# EasyEDA Pro project 自动分拣系统V2.epro

# Schematic Schematic1
Create Date: 2025-10-03; Page Name: P1; Project Name: 自动分拣系统; Schematic Name: Schematic1; Update Date: 2025-10-03; Company: 嘉立创EDA; Page Size: A4; Version: V1.0
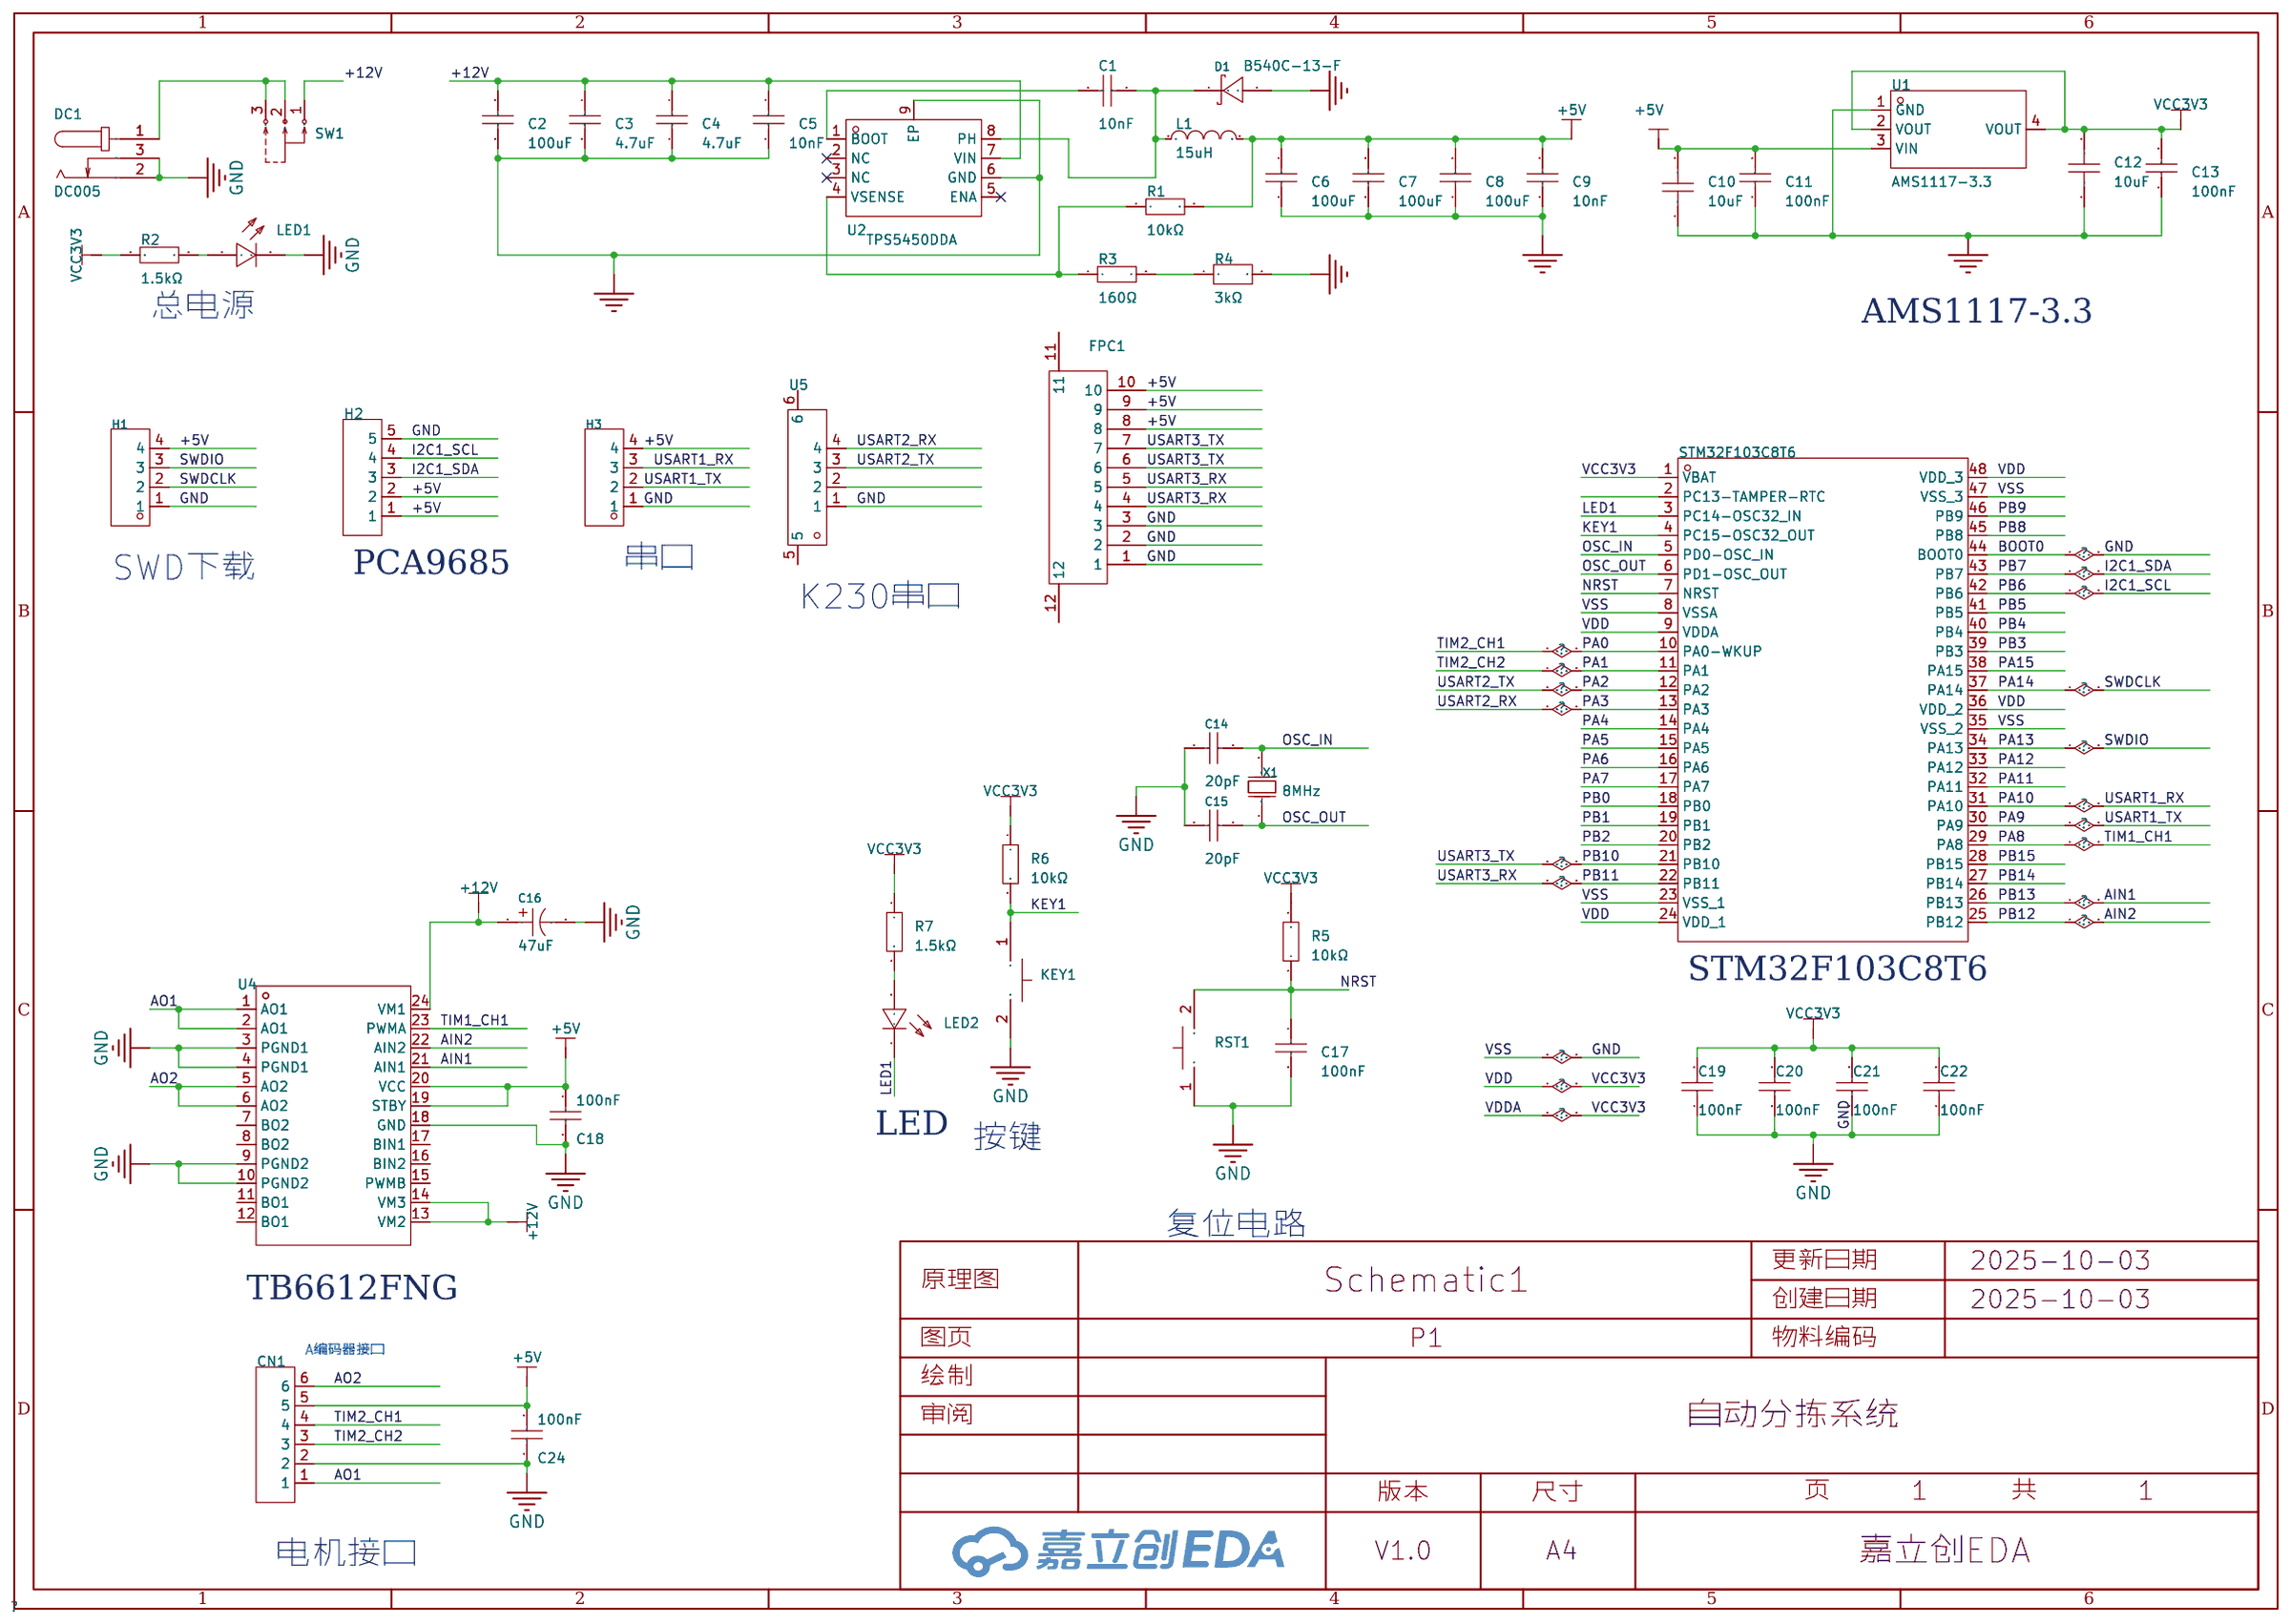
[diagram p0: schematic sheet]

## Parts
C1  10nF  [C0603]
C2  100uF  [C1206]
C3  4.7uF  [C0603]
C4  4.7uF  [C0603]
C5  10nF  [C0603]
C6  100uF  [C1206]
C7  100uF  [C1206]
C8  100uF  [C1206]
C9  10nF  [C0603]
C10  10uF  [C0603]
C11  100nF  [C0603]
C12  10uF  [C0603]
C13  100nF  [C0603]
C14  20pF  [C0603]
C15  20pF  [C0603]
C16  47uF  [CAP-SMD_BD6.3-L6.6-W6.6-LS7.2-FD]
C17  100nF  [C0603]
C18  100nF  [C0603]
C19  100nF  [C0603]
C20  100nF  [C0603]
C21  100nF  [C0603]
C22  100nF  [C0603]
C24  100nF  [C0603]
CN1  BX-PH2.0-6PWZ  [CONN-TH_6P-P2.00_BX-PH2.0-6PWZ]
D1  B540C-13-F  [SMC_L7.1-W6.2-LS8.1-RD]
DC1  DC005  [DC-IN-TH_DC005]
FPC1  AFC01-S10FCA-00  [FPC-SMD_P0.5-10P_FGS-XJ-H2.0]
H1  PZ254V-11-04P  [HDR-TH_4P-P2.54-V-M]
H2  PZ254V-11-05P  [HDR-TH_5P-P2.54-V-M]
H3  PZ254V-11-04P  [HDR-TH_4P-P2.54-V-M]
KEY1  3*6*5贴片-2P  [SW-SMD_L6.0-W3.5-LS8.0]
L1  15uH  [IND-SMD_L7.0-W6.6_FXL0630]
LED1  NCD0603G1  [LED0603-RD]
LED2  NCD0603G1  [LED0603-RD]
R1  10kΩ  [R0603]
R2  1.5kΩ  [R0603]
R3  160Ω  [R0603]
R4  3kΩ  [R0603]
R5  10kΩ  [R0603]
R6  10kΩ  [R0603]
R7  1.5kΩ  [R0603]
RST1  3*6*5贴片-2P  [SW-SMD_L6.0-W3.5-LS8.0]
SW1  SS12D10/G5/直角  [SW-TH_SHOU-HAN_SS12D10G4]
U1  AMS1117-3.3  [SOT-223-3_L6.5-W3.4-P2.30-LS7.0-BR]
U2  TPS5450DDA  [SOP-8_L4.9-W3.9-P1.27-LS6.0-TL-EP-1]
U3  STM32F103C8T6  [LQFP-48_L7.0-W7.0-P0.50-LS9.0-BL]
U4  TB6612FNG,C,8,EL  [SSOP-24_L8.3-W5.6-P0.65-LS7.6-BL]
U5  1.25-4PWT  [CONN-SMD_4P-P1.25-4PWT]
X1  8MHz  [CRYSTAL-SMD_4P-L3.2-W2.5-BL_SIT8008BI]

## Library data of the parts
C1 C5 C9 = CC0603KRX7R9BB103: 容值:10nF;精度:±10%;额定电压:50V;材质(温度系数):X7R;; LCSC Part Name: 10nF ±10% 50V; Supplier Part: C100042; Manufacturer: YAGEO(国巨); Supplier Footprint: 0603; JLCPCB Part Class: 扩展库; Datasheet: https://atta.szlcsc.com/upload/public/pdf/source/20181008/C309510_22F155564471FAF6A489F7D68F34234E.pdf; Supplier: LCSC; Tolerance: ±10%; Voltage Rated: 50V; Temperature Coefficient: X7R
C2 C6-C8 = CL31A107MQHNNNE: 容值:100uF;精度:±20%;额定电压:6.3V;材质(温度系数):X5R;; LCSC Part Name: 100uF ±20% 6.3V; Supplier Part: C15008; Manufacturer: SAMSUNG(三星); Supplier Footprint: 1206; JLCPCB Part Class: 基础库; Datasheet: https://atta.szlcsc.com/upload/public/pdf/source/20160218/1457707763339.pdf; Supplier: LCSC; Tolerance: ±20%; Voltage Rated: 6.3V; Temperature Coefficient: X5R
C3 C4 = CL10A475KA8NQNC: 容值:4.7uF;精度:±10%;额定电压:25V;材质(温度系数):X5R;; LCSC Part Name: 4.7uF ±10% 25V; Supplier Part: C69335; Manufacturer: SAMSUNG(三星); Supplier Footprint: 0603; JLCPCB Part Class: 扩展库; Datasheet: https://atta.szlcsc.com/upload/public/pdf/source/20161108/1478586410580.pdf; Supplier: LCSC; Tolerance: ±10%; Voltage Rated: 25V; Temperature Coefficient: X5R
C10 C12 = GRM21BR61H106KE43L: 容值:10uF;精度:±10%;额定电压:50V;材质(温度系数):X5R;; LCSC Part Name: 10uF ±10% 50V; Supplier Part: C440198; Manufacturer: muRata(村田); Supplier Footprint: 0805; JLCPCB Part Class: 基础库; Datasheet: https://atta.szlcsc.com/upload/public/pdf/source/20230811/95AAE0C9AF55EDC31B7A4D8B733F534E.pdf; Supplier: LCSC; Tolerance: ±10%; Voltage Rated: 50V; Temperature Coefficient: X5R
C11 C13 = 0603B104K500NT: 容值:100nF;精度:±10%;额定电压:50V;材质(温度系数):X7R;; LCSC Part Name: 100nF ±10% 50V; Supplier Part: C30926; Manufacturer: FH(风华); Supplier Footprint: 0603; JLCPCB Part Class: 扩展库; Datasheet: https://atta.szlcsc.com/upload/public/pdf/source/20200305/C486355_26A10D38EF8C2A5C37091D0039909270.pdf; Supplier: LCSC; Tolerance: ±10%; Voltage Rated: 50V; Temperature Coefficient: X7R
C14 C15 = CL10C200JB8NNNC: 容值:20pF;精度:±5%;额定电压:50V;材质(温度系数):C0G;; LCSC Part Name: 20pF ±5% 50V; Supplier Part: C1648; Manufacturer: SAMSUNG(三星); Supplier Footprint: 0603; JLCPCB Part Class: Basic Part; Datasheet: https://atta.szlcsc.com/upload/public/pdf/source/20160218/1457707763339.pdf; Supplier: LCSC; Tolerance: ±5%; Voltage Rated: 50V; Temperature Coefficient: C0G
C16 = RVT47UF35V67RV0039: 容值:47uF;额定电压:35V;电容体直径:-;电容体长度:-;纹波电流:-;等效串联电阻:-;工作寿命:2000hrs@105℃;; LCSC Part Name: 47uF 35V; Supplier Part: C2836440; Manufacturer: KNSCHA(科尼盛); Supplier Footprint: SMD,6.3x5.4mm; JLCPCB Part Class: 扩展库; Supplier: LCSC; Rated Voltage: 35V; Lifetime @ Temp: 2000hrs@105℃
C17 C18 C24 = 0603B104K500NT: 容值:100nF;精度:±10%;额定电压:50V;材质(温度系数):X7R;; LCSC Part Name: 100nF ±10% 50V; Supplier Part: C30926; Manufacturer: FH(风华); Supplier Footprint: 0603; JLCPCB Part Class: 扩展库; Datasheet: https://atta.szlcsc.com/upload/public/pdf/source/20170923/C30926_1506149436298988724.pdf; Supplier: LCSC; Tolerance: ±10%; Voltage Rated: 50V; Temperature Coefficient: X7R
C19-C22 = 0603B104K500NT: 容值:100nF;精度:±10%;额定电压:50V;材质(温度系数):X7R;; LCSC Part Name: 100nF ±10% 50V; Supplier Part: C30926; Manufacturer: FH(风华); Supplier Footprint: 0603; JLCPCB Part Class: Extended Part; Datasheet: https://atta.szlcsc.com/upload/public/pdf/source/20200305/C486355_26A10D38EF8C2A5C37091D0039909270.pdf; Supplier: LCSC; Tolerance: ±10%; Voltage Rated: 50V; Temperature Coefficient: X7R
CN1 = BX-PH2.0-6PWZ: 插针结构:1x6P;间距:2mm;安装方式:弯插;参考系列:PH;总PIN数:6P;排数:1;每排PIN数:6;行距:-;额定电流:2A;触头材质:黄铜;触头镀层:锡;工作温度:-25℃~+85℃;; LCSC Part Name: 1x6P 间距:2mm 弯插 系列:PH; Supplier Part: C18077757; Manufacturer: Bossie(博锡); Supplier Footprint: 弯插,P=2mm; JLCPCB Part Class: 扩展库; Datasheet: https://item.szlcsc.com/datasheet/BX-PH2.0-6PWZ/19218158.html; Supplier: LCSC; Pins Structure: 1x6P; Pitch: 2mm; Mounting Type: 弯插; Reference Series: PH; Number of Pins: 6P; Number of Rows: 1; Number of PINs Per Row: 6; Current Rating: 2A; Contact Material: 黄铜; Contact Plating: 锡; Operating Temperature: -25℃~+85℃; Voltage Rating: 250V; Plastic Material: PA66; Flame Retardant Rating: UL94V-0; Color: 白色; Z-Height of the Board: 4.7mm; X-Length of Bottom Edge on Board (Spacing Line): 14mm; Y-Width of Bottom Edge on Board: 6.05mm
D1 = B540C-13-F: 直流反向耐压(Vr):40V;平均整流电流(Io):5A;正向压降(Vf):550mV@5A;; LCSC Part Name: 电压:40V 电流:5A; Supplier Part: C72264; Manufacturer: DIODES(美台); Supplier Footprint: SMC(DO-214AB); JLCPCB Part Class: 扩展库; Datasheet: https://atta.szlcsc.com/upload/public/pdf/source/20171023/C134461_15087453602301052556.pdf; Supplier: LCSC; Reverse Voltage (Vr): 40V; Average Rectified Current (Io): 5A; Forward Voltage (Vf@If): 550mV@5A; Reverse Leakage Current (Ir): 500uA@40V
DC1 = DC005: 连接器类型:DC电源插座;安装方式:弯插;触点内径:2mm;触点外径:6.3mm;额定电流:500mA;额定电压:30V;工作温度范围:-40℃~+55℃;; LCSC Part Name: DC电源插座 内径:2mm 外径:6.3mm; Supplier Part: C431533; Manufacturer: SHOU HAN(首韩); Supplier Footprint: 插件; JLCPCB Part Class: 扩展库; Datasheet: https://atta.szlcsc.com/upload/public/pdf/source/20190925/C431533_4751811035784AC1D38EBC85F7905E99.pdf; Supplier: LCSC; Connector Type: DC电源插座; Mounting Style: 弯插; Inside Contact Diameter: 2mm; Outside Contact Diameter: 6.3mm; Current Rating (Max): 500mA; Voltage Rating (Max): 30V; Operating Temperature Range: -40℃~+55℃
FPC1 = AFC01-S10FCA-00: 锁定特性:翻盖式;触点类型:下接;触点数量:10P;间距:0.5mm;安装方式:卧贴;; LCSC Part Name: 间距:0.5mm P数:10P 翻盖式 下接; Supplier Part: C262659; Manufacturer: JS(钜硕电子); Supplier Footprint: SMD,P=0.5mm,卧贴; Datasheet: https://item.szlcsc.com/datasheet/AFC01-S10FCA-00/253918.html; Supplier: LCSC; Locking Feature: 翻盖式; Contact Type: 下接; Number of Contacts: 10P; Pitch: 0.5mm; Mounting Type: 卧贴; FFC, FCB Thickness: 0.3mm; Height Above Board: 2mm
H1 H3 = PZ254V-11-04P: 排数:单排;总PIN位数:4P;间距:2.54mm;插针结构:1x4P;行距:-;安装类型:直插;圆针/方针:方针;额定电流:3A;额定电压:250V;配合针长度:6mm;塑高:2.5mm;端接针长度:3mm;触头材质:-;工作温度范围:-40℃~+105℃;颜色:黑色;; LCSC Part Name: 2.54mm 1x4P 直插 方针; Supplier Part: C2691448; Manufacturer: XFCN(兴飞); Supplier Footprint: 插件,P=2.54mm; JLCPCB Part Class: 扩展库; Datasheet: https://atta.szlcsc.com/upload/public/pdf/source/20200309/C492403_F9F19131791D08044AD4F84F8E751A34.pdf; Supplier: LCSC; Number of Rows: 单排; Number of Pins: 4P; Pitch: 2.54mm; Pin Structure: 1x4P; Mounting Type: 直插; Circluar Pins/Square Pins: 方针; Current Rating (Max): 3A; Voltage Rating (Max): 250V; Length of Mating Pin: 6mm; Insulation Height: 2.5mm; Length of End Connection Pin: 3mm; Operating Temperature Range: -40℃~+105℃; Color: 黑色
H2 = PZ254V-11-05P: 插针结构:1x5P;间距:2.54mm;行距:-;圆针/方针:方针;安装方式:直插;排数:单排;总PIN位数:5P;额定电流:-;额定电压:-;配合针长度:6mm;塑高:2.5mm;端接针长度:3mm;触头材质:黄铜;触头镀层:-;工作温度:-40℃~+105℃;颜色:黑色;; LCSC Part Name: 1x5P 间距:2.54mm 方针 直插; Supplier Part: C492404; Manufacturer: XFCN(兴飞); Supplier Footprint: 插件,P=2.54mm; JLCPCB Part Class: 扩展库; Datasheet: https://atta.szlcsc.com/upload/public/pdf/source/20200309/C492404_E51533260F8710EFF5D4617281164C1D.pdf; Supplier: LCSC; Pin Structure: 1x5P; Pitch: 2.54mm; Circluar Pins/Square Pins: 方针; Mounting Type: 直插; Number of Rows: 单排; Number of Pins: 5P; Length of Mating Pin: 6mm; Insulation Height: 2.5mm; Length of End Connection Pin: 3mm; Contact Material: 黄铜; Operating Temperature: -40℃~+105℃; Color: 黑色
KEY1 RST1 = 3*6*5贴片-2P: Supplier Part: C9900011307; Supplier Footprint: SW-SMD; JLCPCB Part Class: 扩展库; Supplier: LCSC
L1 = FXL0630-150-M: 电感值:15uH;精度:±20%;额定电流:3A;类型:一体成型电感;饱和电流(Isat):4.5A;; LCSC Part Name: 15uH ±20% 4.5A; Supplier Part: C177243; Manufacturer: cjiang(长江微电); Supplier Footprint: SMD,6.6x7mm; JLCPCB Part Class: 扩展库; Datasheet: https://atta.szlcsc.com/upload/public/pdf/source/20230516/3A080F5AF8C87BB81C3BA86E5F60E51A.pdf; Supplier: LCSC; Tolerance: ±20%; Rated Current: 3A; Type: 一体成型电感; DC Resistance (DCR): 115mΩ; Saturation Current (Isat): 4.5A
LED1 LED2 = NCD0603G1: 发光颜色:翠绿色;正向电压(VF):2.6V~3.6V;功率:72mW;正向电流:10mA;主波长:515nm~530nm;透镜颜色:无色透明;发光强度:330mcd~900mcd;发光角度:130°;工作温度:-30℃~+85℃;; Supplier Part: C84267; Manufacturer: 国星光电; Supplier Footprint: 0603; JLCPCB Part Class: 扩展库; Datasheet: https://atta.szlcsc.com/upload/public/pdf/source/20200820/C84267_04BA7703640BAC111D09F5EFB971FBF3.pdf; Supplier: LCSC; Emitted Color: 翠绿色; Forward Voltage (VF): 2.6V~3.6V; Power Dissipation: 72mW; Forward Current: 10mA; Dominant Wavelength: 515nm~530nm; Lens Color: 无色透明; Luminous Intensity: 330mcd~900mcd; Viewing Angle: 130°; Operating Temperature: -30℃~+85℃
R1 R5 R6 = 0603WAF1002T5E: 阻值:10kΩ;精度:±1%;功率:100mW;温度系数:±100ppm/℃;电阻类型:厚膜电阻;; LCSC Part Name: 10kΩ ±1% 100mW 厚膜电阻; Supplier Part: C25804; Manufacturer: UNI-ROYAL(厚声); Supplier Footprint: 0603; JLCPCB Part Class: 基础库; Datasheet: https://atta.szlcsc.com/upload/public/pdf/source/20200306/C422600_1E6D84923E4A46A82E41ADD87F860B5C.pdf; Supplier: LCSC; Tolerance: ±1%; Power(Watts): 100mW; Overload Voltage (Max): 75V; Temperature Coefficient: ±100ppm/℃; Type: 厚膜电阻; Operating Temperature Range: -55℃~+155℃
R2 R7 = 0603WAF1501T5E: 阻值:1.5kΩ;精度:±1%;功率:100mW;温度系数:±100ppm/℃;电阻类型:厚膜电阻;; LCSC Part Name: 1.5kΩ ±1% 100mW 厚膜电阻; Supplier Part: C22843; Manufacturer: UNI-ROYAL(厚声); Supplier Footprint: 0603; JLCPCB Part Class: 基础库; Datasheet: https://atta.szlcsc.com/upload/public/pdf/source/20200306/C422600_1E6D84923E4A46A82E41ADD87F860B5C.pdf; Supplier: LCSC; Tolerance: ±1%; Power(Watts): 100mW; Overload Voltage (Max): 75V; Temperature Coefficient: ±100ppm/℃; Type: 厚膜电阻; Operating Temperature Range: -55℃~+155℃
R3 = 0603WAF0000T5E: 阻值:0Ω;精度:±1%;功率:100mW;电阻类型:厚膜电阻;; LCSC Part Name: 0Ω ±1% 100mW 厚膜电阻; Supplier Part: C21189; Manufacturer: UNI-ROYAL(厚声); Supplier Footprint: 0603; JLCPCB Part Class: 基础库; Datasheet: https://atta.szlcsc.com/upload/public/pdf/source/20200306/C422600_1E6D84923E4A46A82E41ADD87F860B5C.pdf; Supplier: LCSC; Tolerance: ±1%; Power(Watts): 100mW; Overload Voltage (Max): 75V; Type: 厚膜电阻; Operating Temperature Range: -55℃~+155℃
R4 = FRC0603F3161TS: 阻值:3.16kΩ;精度:±1%;功率:100mW;温度系数:±100ppm/℃;电阻类型:厚膜电阻;; LCSC Part Name: 3.16kΩ ±1% 100mW 厚膜电阻; Supplier Part: C2930087; Manufacturer: FOJAN(富捷); Supplier Footprint: 0603; JLCPCB Part Class: 扩展库; Datasheet: https://atta.szlcsc.com/upload/public/pdf/source/20211221/925EC7D7225764EE0046F22065062C87.pdf; Supplier: LCSC; Tolerance: ±1%; Power(Watts): 100mW; Overload Voltage (Max): 75V; Temperature Coefficient: ±100ppm/℃; Type: 厚膜电阻; Operating Temperature Range: -55℃~+155℃
SW1 = SS12D10/G5/直角: Supplier Part: C9900029541; Supplier Footprint: THrough hole; JLCPCB Part Class: 扩展库; Supplier: LCSC
U1 = AMS1117-3.3_C6186: 输出类型:固定;最大输入电压:-;输出电压:3.3V;输出电流:1A;电源纹波抑制比(PSRR):72dB@(120Hz);输出极性:正;; LCSC Part Name: 输出3.3V 1A; Supplier Part: C6186; Manufacturer: AMS; Supplier Footprint: SOT-223-3; JLCPCB Part Class: 基础库; Datasheet: https://atta.szlcsc.com/upload/public/pdf/source/20180727/C6186_7A095716F0823C02F1997A905E26C086.pdf; Supplier: LCSC; Output Type: 固定; Output Voltage: 3.3V; Output Current: 1A; Power Supply Rejection Ratio (PSRR): 72dB@(120Hz); Dropout Voltage: 1.3V@(800mA); Output Polarity: 正; Number of Outputs: 1
U2 = TPS5450DDA: 功能类型:降压型;同步整流:否;输出类型:可调;输出通道数:1;拓扑结构:降压式;输入电压:5.5V~36V;输出电压:1.221V~31.32V;输出电流(最大值):5A;开关频率:500kHz;工作温度:-40℃~+125℃@(TJ);; LCSC Part Name: 降压型 Vin=5.5V~36V Vout=1.221V~31.32V 5A; Supplier Part: C1355315; Manufacturer: TI(德州仪器); Supplier Footprint: Power-Pad-SO-8; JLCPCB Part Class: 扩展库; Supplier: LCSC; Function: 降压型; Synchronous Rectification: 否; Output Type: 可调; Number of Outputs: 1; Topology: 降压式; Input Voltage: 5.5V~36V; Output Voltage: 1.221V~31.32V; Output Current (Max): 5A; Switching Frequency: 500kHz; Operating Temperature: -40℃~+125℃@(TJ)
U3 = STM32F103C8T6: CPU内核:ARM Cortex-M3;CPU最大主频:72MHz;程序存储容量:64KB;程序存储器类型:FLASH;RAM总容量:20KB;GPIO端口数量:37;ADC(位数):12bit;工作温度范围:-40℃~+85℃;; LCSC Part Name: ARM Cortex-M3 72MHz MSL=3; Supplier Part: C8734; Manufacturer: ST(意法半导体); Supplier Footprint: LQFP-48(7x7); JLCPCB Part Class: 基础库; Datasheet: https://atta.szlcsc.com/upload/public/pdf/source/20220812/8363ACEC51AD55ECEB84799464F7CB85.pdf; Supplier: LCSC; CPU Core: ARM Cortex-M3; CPU Maximum Speed: 72MHz; Operating Voltage Range: 2V~3.6V; Program Storage Size: 64KB; Program Memory Type: FLASH; RAM Size: 20KB; EEPROM: 64KB; GPIO Ports Number: 37; ADC (Bit): 12bit; Peripheral/Function: 看门狗；DMA；看门狗；片载温度传感器; Internal Oscillator: 有; Operating Temperature Range: -40℃~+85℃
U4 = TB6612FNG,C,8,EL: 类型:有刷直流电机;电源电压:2.7V~5.5V;输出电流:1A;接口:并行;; Supplier Part: C141517; Manufacturer: TOSHIBA(东芝); Supplier Footprint: SSOP-24; JLCPCB Part Class: 扩展库; Datasheet: https://atta.szlcsc.com/upload/public/pdf/source/20171128/C141517_15118625624231147036.pdf; Supplier: LCSC; Type: 有刷直流电机; Supply Voltage: 2.7V~5.5V; Output Current: 1A; Interface: 并行; Operating Temperature: -20℃~+85℃@(Ta)
U5 = 1.25-4PWT: Supplier Part: C9900004898; Supplier Footprint: CONN-SMD_4P-P1.25-L10.25-LS5.5; JLCPCB Part Class: 扩展库; Supplier: LCSC
X1 = X49SD8MSD2SC: 晶振类型:直插晶振;频率:8MHz;常温频差:±20ppm;外接负载电容:20pF;频率稳定度(全温):±30ppm;; LCSC Part Name: 8MHz ±20ppm 20pF; Supplier Part: C21263; Manufacturer: YXC(扬兴晶振); Supplier Footprint: HC-49S; JLCPCB Part Class: Extended Part; Datasheet: https://atta.szlcsc.com/upload/public/pdf/source/20210903/A997D130AE99CBB55D9024F9BE6DA174.pdf; Supplier: LCSC; Crystal Type: 直插晶振; Normal temperature Frequency Tolerance: ±20ppm; External load capacitor: 20pF; Frequency Stability(Full temperature range): ±30ppm; Operating Temperature: -20℃~+70℃; Frequency Tolerance: ±10ppm; Frequency Stability: ±50ppm; Load Capacitance: 20pF

## Nets
+5V: C6.2 C7.2 C8.2 C9.2 C10.2 C11.2 C18.1 C24.1 CN1.5 FPC1.8 FPC1.9 FPC1.10 H1.4 H2.1 H2.2 H3.4 L1.2 R1.2 U1.3(VIN) U4.19(STBY) U4.20(VCC)
+12V: C2.2 C3.1 C4.1 C5.2 C16.1 SW1.1 U2.7(VIN) U4.13(VM2) U4.14(VM3) U4.24(VM1)
GND: C2.1 C3.2 C4.2 C5.1 C6.1 C7.1 C8.1 C9.1 C10.1 C11.1 C12.1 C13.1 C14.2 C15.2 C16.2 C17.2 C18.2 C19.1 C20.1 C21.1 C22.1 C24.2 CN1.2 D1.2(A) DC1.2 DC1.3 FPC1.1 FPC1.2 FPC1.3 H1.1 H2.5 H3.1 KEY1.2 LED1.1(K) R4.2 RST1.1 U1.1(GND) U2.6(GND) U2.9(EP) U3.8(VSSA) U3.23(VSS_1) U3.35(VSS_2) U3.44(BOOT0) U3.47(VSS_3) U4.3(PGND1) U4.4(PGND1) U4.9(PGND2) U4.10(PGND2) U4.18(GND) U5.1
VCC3V3: C12.2 C13.2 C19.2 C20.2 C21.2 C22.2 R2.1 R5.2 R6.1 R7.1 U1.2(VOUT) U1.4(VOUT) U3.1(VBAT) U3.9(VDDA) U3.24(VDD_1) U3.36(VDD_2) U3.48(VDD_3)
AIN1: U3.26(PB13) U4.21(AIN1)
AIN2: U3.25(PB12) U4.22(AIN2)
AO1: CN1.1 U4.1(AO1) U4.2(AO1)
AO2: CN1.6 U4.5(AO2) U4.6(AO2)
I2C1_SCL: H2.4 U3.42(PB6)
I2C1_SDA: H2.3 U3.43(PB7)
KEY1: KEY1.1 R6.2 U3.4(PC15-OSC32_OUT)
LED1: LED2.1(K) U3.3(PC14-OSC32_IN)
NRST: C17.1 R5.1 RST1.2 U3.7(NRST)
OSC_IN: C14.1 U3.5(PD0-OSC_IN) X1.2(OSC2)
OSC_OUT: C15.1 U3.6(PD1-OSC_OUT) X1.1(OSC1)
PA0: CN1.4 U3.10(PA0-WKUP)
PA1: CN1.3 U3.11(PA1)
PA2: U3.12(PA2) U5.3
PA3: U3.13(PA3) U5.4
PA4: U3.14(PA4)
PA5: U3.15(PA5)
PA6: U3.16(PA6)
PA7: U3.17(PA7)
PA8: U3.29(PA8) U4.23(PWMA)
PA9: H3.2 U3.30(PA9)
PA10: H3.3 U3.31(PA10)
PA11: U3.32(PA11)
PA12: U3.33(PA12)
PA13: H1.3 U3.34(PA13)
PA14: H1.2 U3.37(PA14)
PA15: U3.38(PA15)
PB0: U3.18(PB0)
PB1: U3.19(PB1)
PB2: U3.20(PB2)
PB3: U3.39(PB3)
PB4: U3.40(PB4)
PB5: U3.41(PB5)
PB8: U3.45(PB8)
PB9: U3.46(PB9)
PB10: FPC1.6 FPC1.7 U3.21(PB10)
PB11: FPC1.4 FPC1.5 U3.22(PB11)
PB14: U3.27(PB14)
PB15: U3.28(PB15)
$1N3060: LED1.2(A) R2.2
$1N3483: LED2.2(A) R7.2
$1N5689: R3.2 R4.1
$1N5690: R1.1 R3.1 U2.4(VSENSE)
$1N5697: C1.2 U2.1(BOOT)
$1N5698: C1.1 D1.1(K) L1.1 U2.8(PH)
$1N11600: DC1.1 SW1.2 SW1.3

Not connected (* = marked no-connect by the designer): FPC1 11 12; U2 2(NC)* 3(NC)* 5(ENA)*; U3 2(PC13-TAMPER-RTC); U4 7(BO2) 8(BO2) 11(BO1) 12(BO1) 15(PWMB) 16(BIN2) 17(BIN1); U5 2 5 6

## Notes on the sheet
- 总电源
- AMS1117-3.3
- SWD下载
- PCA9685
- 串口
- K230串口
- STM32F103C8T6
- LED
- 按键
- 复位电路
- TB6612FNG
- A编码器接口
- 电机接口

# Board PCB1
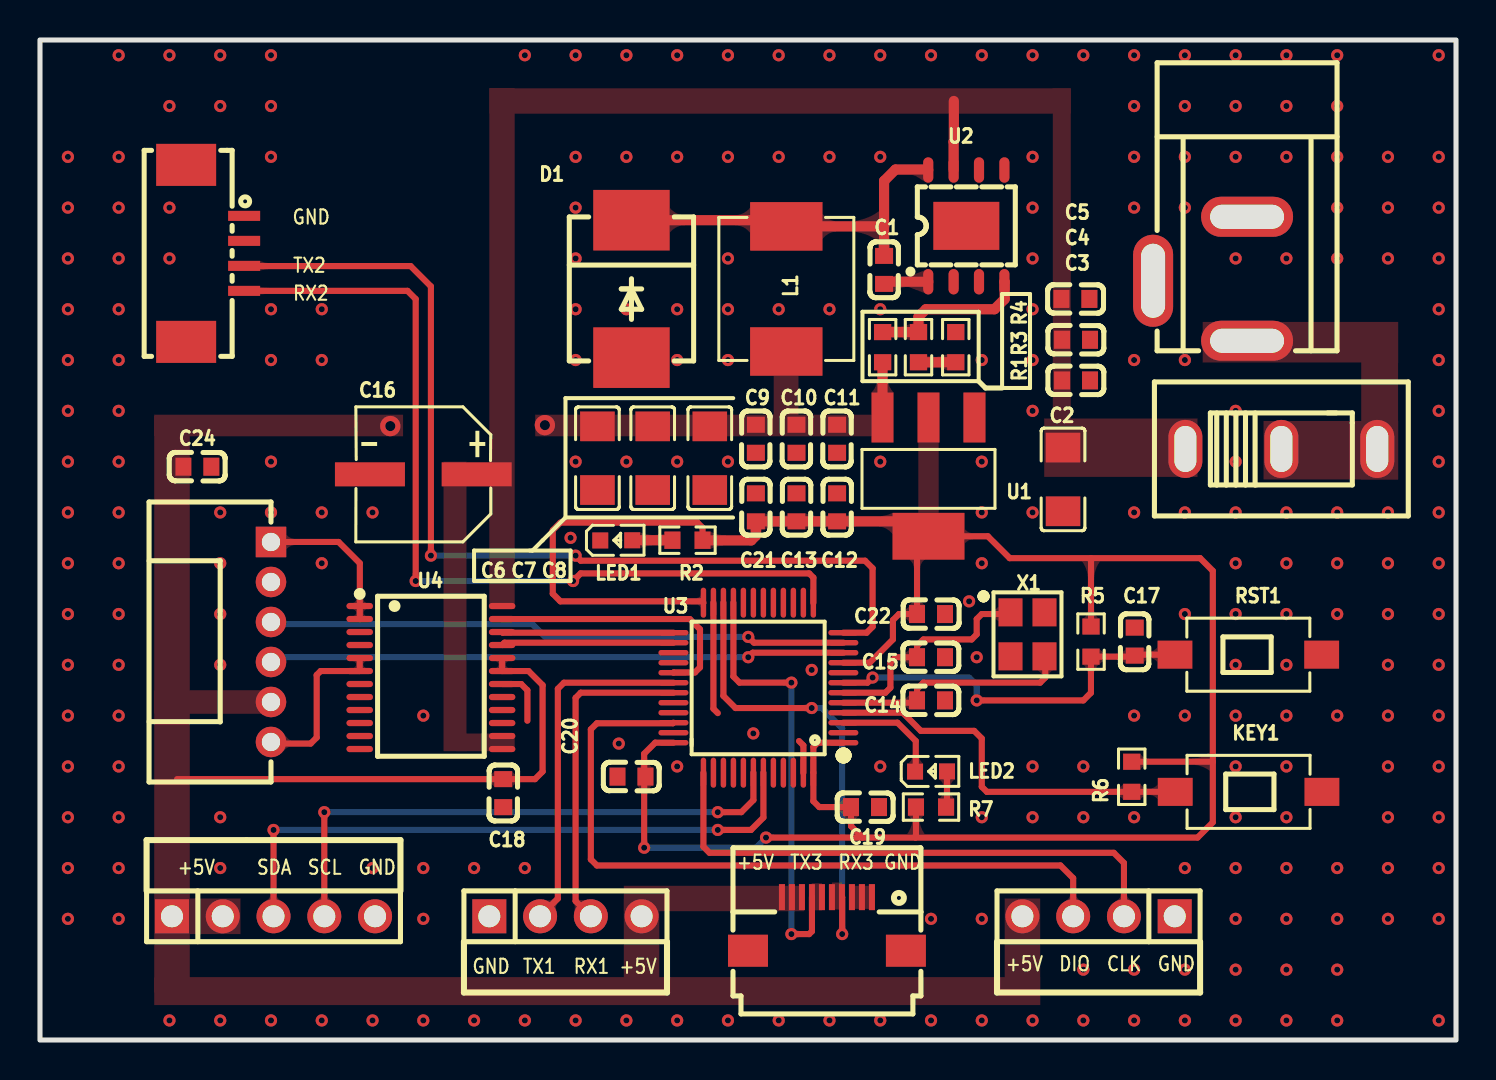
[diagram p1: board, top side]
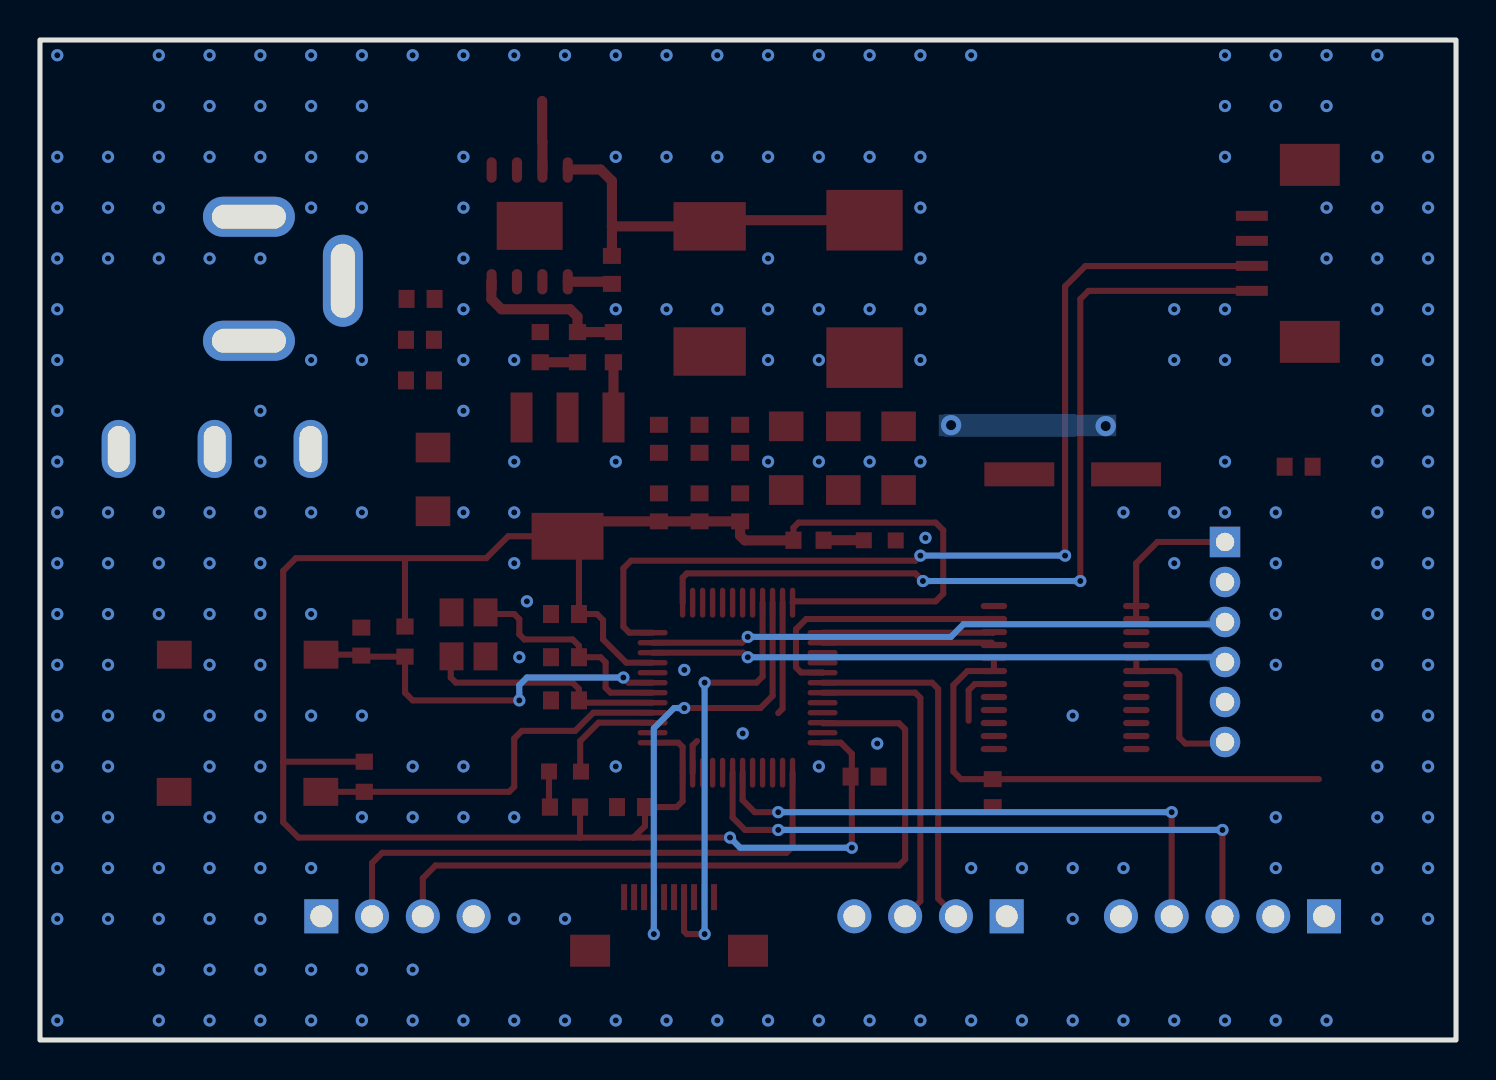
[diagram p2: board, bottom side, seen from below]

Outline 70.84 x 50 mm; copper layers: Top Layer, Inner1, Inner2, Inner3, Inner4, Bottom Layer. Coordinates in mm from the lower left corner of the outline.
Outline path: rectangle 0,50 70.84,0
Stack: Top Layer 0.035mm 外层铜厚1oz / Dielectric1 0.0994mm 3313 RC57% 4.2mil / Inner1 0.0152mm 内层铜厚 / Dielectric2 0.55mm 0.55mm H/H不含铜 / Inner2 0.0152mm 内层铜厚 / Dielectric3 0.1088mm 2116 RC54% 4.9mil / Inner3 0.0152mm 内层铜厚 / Dielectric4 0.55mm 0.55mm H/H不含铜 / Inner4 0.0152mm 内层铜厚 / Dielectric5 0.0994mm 3313 RC57% 4.2mil / Bottom Layer 0.035mm 外层铜厚1oz

## Design rules (mm)
template: JLCPCB Capability(Two Layers Board)
spacing copperThickness1oz (default): track to track 0.102, other pairs 0.152 to 0.3
spacing copperThickness2oz: track to track 0.203, other pairs 0.152 to 0.3
track width copperThickness1oz (default): min 0.127, default 0.254, max 2.54
track width copperThickness2oz: min 0.203, default 0.254, max 2.54
differential pair differentialPair (default): width min 0.127, default 0.254, max 2.54; gap min 0.152, default 0.152
via viaSize (default): diameter min 0.5, default 0.61, max 10; hole min 0.3, default 0.305, max 6.3

## Placement (name value [footprint] x y rotation side)
C1  10nF  [C0603]  42.23 38.5 270 top
C2  100uF  [C1206]  51.18 28.03 90 top
C3  4.7uF  [C0603]  51.83 32.98 0 top
C4  4.7uF  [C0603]  51.83 35.01 0 top
C5  10nF  [C0603]  51.8 37.05 180 top
C6  100uF  [C1206]  27.89 29.09 90 top
C7  100uF  [C1206]  30.65 29.09 90 top
C8  100uF  [C1206]  33.51 29.09 90 top
C9  10nF  [C0603]  35.81 30.06 90 top
C10  10uF  [C0603]  37.85 30.06 90 top
C11  100nF  [C0603]  39.88 30.06 90 top
C12  10uF  [C0603]  39.88 26.63 270 top
C13  100nF  [C0603]  37.85 26.63 270 top
C14  20pF  [C0603]  44.58 16.98 0 top
C15  20pF  [C0603]  44.58 19.14 0 top
C16  47uF  [CAP-SMD_BD6.3-L6.6-W6.6-LS7.2-FD]  19.18 28.28 180 top
C17  100nF  [C0603]  54.77 19.92 90 top
C18  100nF  [C0603]  23.18 12.34 270 top
C19  100nF  [C0603]  41.27 11.65 180 top
C20  100nF  [C0603]  29.59 13.17 0 top
C21  100nF  [C0603]  35.81 26.63 270 top
C22  100nF  [C0603]  44.58 21.3 180 top
C24  100nF  [C0603]  7.87 28.66 0 top
CN1  BX-PH2.0-6PWZ  [CONN-TH_6P-P2.00_BX-PH2.0-6PWZ]  11.56 19.9 270 top
D1  B540C-13-F  [SMC_L7.1-W6.2-LS8.1-RD]  29.59 37.55 270 top
DC1  DC005  [DC-IN-TH_DC005]  58.04 38.06 270 top
FPC1  AFC01-S10FCA-00  [FPC-SMD_P0.5-10P_FGS-XJ-H2.0]  39.37 5.8 180 top
H1  PZ254V-11-04P  [HDR-TH_4P-P2.54-V-M]  52.96 6.18 180 top
H2  PZ254V-11-05P  [HDR-TH_5P-P2.54-V-M]  11.68 6.18 0 top
H3  PZ254V-11-04P  [HDR-TH_4P-P2.54-V-M]  26.29 6.18 0 top
KEY1  3*6*5贴片-2P  [SW-SMD_L6.0-W3.5-LS8.0]  60.46 12.41 0 top
L1  15uH  [IND-SMD_L7.0-W6.6_FXL0630]  37.34 37.55 90 top
LED1  NCD0603G1  [LED0603-RD]  28.83 24.98 0 top
LED2  NCD0603G1  [LED0603-RD]  44.58 13.42 0 top
R1  10kΩ  [R0603]  42.16 34.64 270 top
R2  1.5kΩ  [R0603]  32.39 24.99 180 top
R3  160Ω  [R0603]  43.95 34.64 270 top
R4  3kΩ  [R0603]  45.81 34.64 90 top
R5  10kΩ  [R0603]  52.58 19.92 90 top
R6  10kΩ  [R0603]  54.62 13.16 270 top
R7  1.5kΩ  [R0603]  44.58 11.65 0 top
RST1  3*6*5贴片-2P  [SW-SMD_L6.0-W3.5-LS8.0]  60.45 19.27 180 top
SW1  SS12D10/G5/直角  [SW-TH_SHOU-HAN_SS12D10G4]  62.1 29.55 0 top
U1  AMS1117-3.3  [SOT-223-3_L6.5-W3.4-P2.30-LS7.0-BR]  44.45 28.16 90 top
U2  TPS5450DDA  [SOP-8_L4.9-W3.9-P1.27-LS6.0-TL-EP-1]  46.34 40.71 90 top
U3  STM32F103C8T6  [LQFP-48_L7.0-W7.0-P0.50-LS9.0-BL]  35.94 17.61 90 top
U4  TB6612FNG,C,8,EL  [SSOP-24_L8.3-W5.6-P0.65-LS7.6-BL]  19.56 18.12 270 top
U5  1.25-4PWT  [CONN-SMD_4P-P1.25-4PWT]  8.76 39.33 270 top
X1  8MHz  [CRYSTAL-SMD_4P-L3.2-W2.5-BL_SIT8008BI]  49.4 20.28 270 top

## Footprints (pads in the part's own frame, mm; a bottom-side part is the same pattern mirrored in y, then rotated)
C0603
  rect 0.8x0.9 smd: 1(-0.7,0) 2(0.7,0)
C1206
  rect 1.485x1.728 smd: 1(-1.593,0) 2(1.593,0)
CAP-SMD_BD6.3-L6.6-W6.6-LS7.2-FD
  rect 3.5x1.2 smd: 1(-2.67,0) 2(2.67,0)
CONN-SMD_4P-P1.25-4PWT
  rect 0.5x1.6 smd: 1(-1.875,1.45) 2(-0.625,1.45) 3(0.625,1.45) 4(1.875,1.45)
  rect 2.1x3 smd: 5(4.425,-1.45) 6(-4.425,-1.45)
CONN-TH_6P-P2.00_BX-PH2.0-6PWZ
  rect 1.524x1.524 hole 0.914: 1(-5,0)
  round 1.524 hole 0.914: 2(-3,0) 3(-1,0) 4(1,0) 5(3,0) 6(5,0)
CRYSTAL-SMD_4P-L3.2-W2.5-BL_SIT8008BI
  rect 1.4x1.2 smd: 1(-1.1,-0.85) 2(1.1,-0.85) 3(1.1,0.85) 4(-1.1,0.85)
DC-IN-TH_DC005
  oval 2x4.6 hole 1.2x3.7: 1(3.1,2.35) 2(-3.1,2.35)
  oval 4.6x2 hole 3.7x1.2: 3(0.1,-2.35)
FPC-SMD_P0.5-10P_FGS-XJ-H2.0
  rect 0.3x1.3 smd: 1(-2.25,-1.339) 2(-1.75,-1.339) 3(-1.25,-1.34) 4(-0.75,-1.339) 5(-0.25,-1.34) 6(0.25,-1.339) 7(0.75,-1.339) 8(1.25,-1.339) 9(1.75,-1.339) 10(2.25,-1.34)
  rect 2x1.6 smd: 11(3.95,1.34) 12(-3.95,1.34)
HDR-TH_4P-P2.54-V-M
  rect 1.7x1.7 hole 1.1: 1(-3.81,0)
  round 1.7 hole 1.1: 2(-1.27,0) 3(1.27,0) 4(3.81,0)
HDR-TH_5P-P2.54-V-M
  rect 1.7x1.7 hole 1.1: 1(-5.08,0)
  round 1.7 hole 1.1: 2(-2.54,0) 3(0,0) 4(2.54,0) 5(5.08,0)
IND-SMD_L7.0-W6.6_FXL0630
  rect 2.424x3.62 smd: 1(3.128,0) 2(-3.128,0)
LED0603-RD
  rect 0.8x0.8 smd: 1(-0.799,-0.004) 2(0.799,0.004)
LQFP-48_L7.0-W7.0-P0.50-LS9.0-BL
  oval 0.27x1.5 smd: 1(-2.75,-4.25) 2(-2.25,-4.25) 3(-1.75,-4.25) 4(-1.25,-4.25) 5(-0.75,-4.25) 6(-0.25,-4.25) 7(0.25,-4.25) 8(0.75,-4.25) 9(1.25,-4.25) 10(1.75,-4.25) 11(2.25,-4.25) 12(2.75,-4.25) 25(2.75,4.25) 26(2.25,4.25) 27(1.75,4.25) 28(1.25,4.25) 29(0.75,4.25) 30(0.25,4.25) 31(-0.25,4.25) 32(-0.75,4.25) 33(-1.25,4.25) 34(-1.75,4.25) 35(-2.25,4.25) 36(-2.75,4.25)
  oval 1.5x0.27 smd: 13(4.25,-2.75) 14(4.25,-2.25) 15(4.25,-1.75) 16(4.25,-1.25) 17(4.25,-0.75) 18(4.25,-0.25) 19(4.25,0.25) 20(4.25,0.75) 21(4.25,1.25) 22(4.25,1.75) 23(4.25,2.25) 24(4.25,2.75) 37(-4.25,2.75) 38(-4.25,2.25) 39(-4.25,1.75) 40(-4.25,1.25) 41(-4.25,0.75) 42(-4.25,0.25) 43(-4.25,-0.25) 44(-4.25,-0.75) 45(-4.25,-1.25) 46(-4.25,-1.75) 47(-4.25,-2.25) 48(-4.25,-2.75)
R0603
  rect 0.806x0.864 smd: 1(-0.753,0) 2(0.753,0)
SMC_L7.1-W6.2-LS8.1-RD
  rect 3.03x3.82 smd: 1(-3.435,0) 2(3.435,0)
SOP-8_L4.9-W3.9-P1.27-LS6.0-TL-EP-1
  oval 1.27x0.508 smd: 1(-2.794,1.905) 2(-2.794,0.635) 3(-2.794,-0.635) 4(-2.794,-1.905) 5(2.794,-1.905) 6(2.794,-0.635) 7(2.794,0.635) 8(2.794,1.905)
  rect 2.4x3.3 smd: 9(0,0)
SOT-223-3_L6.5-W3.4-P2.30-LS7.0-BR
  rect 2.5x1.1 smd: 1(2.97,-2.3) 2(2.97,0) 3(2.97,2.3)
  rect 2.34x3.6 smd: 4(-2.97,0)
SSOP-24_L8.3-W5.6-P0.65-LS7.6-BL
  oval 0.308x1.324 smd: 1(-3.575,-3.562) 2(-2.925,-3.562) 3(-2.275,-3.562) 4(-1.625,-3.562) 5(-0.975,-3.562) 6(-0.325,-3.562) 7(0.325,-3.562) 8(0.975,-3.562) 9(1.625,-3.562) 10(2.275,-3.562) 11(2.925,-3.562) 12(3.575,-3.562) 13(3.575,3.562) 14(2.925,3.562) 15(2.275,3.562) 16(1.625,3.562) 17(0.975,3.562) 18(0.325,3.562) 19(-0.325,3.562) 20(-0.975,3.562) 21(-1.625,3.562) 22(-2.275,3.562) 23(-2.925,3.562) 24(-3.575,3.562)
SW-SMD_L6.0-W3.5-LS8.0
  rect 1.74x1.4 smd: 1(-3.67,0) 2(3.67,0)
SW-TH_SHOU-HAN_SS12D10G4
  oval 1.7x2.9 hole 1.1x2.3: 1(-4.8,0) 2(0,0) 3(4.8,0)

## Nets
As in the schematic, except:
OSC_IN: C14.1 U3.5 X1.3

Pads without a net: FPC1 11 12; U2 2 3 5; U4 7 8 11 12 15 16 17; U5 5 6; X1 2 4

## Via types
v1: diameter 0.61, hole 0.305, Top Layer to Bottom Layer, 260 vias
v2: diameter 1.016, hole 0.508, Top Layer to Bottom Layer, 2 vias

## Routing (per net, layer and track width the routed paths; a pad name or vN(x,y) marks a point on that pad's centre or on a via; arc(x,y) is an arc through that point)
+5V: length 28.3
  Top Layer w0.305: U4.20 U4.19 24.44,18.45 25.15,17.74 25.15,13.42 24.77,13.04 C18.1 6.86,13.04
  Top Layer w0.508: 42.15,33.48 42.15,30.87
  vias: v2(17.53,30.7) v2(25.26,30.74)
+12V: length 3.5
  Top Layer w0.508: U2.7 45.71,44.91 45.72,44.92 45.72,46.95
GND: length 10.2
  Top Layer w0.305: 37.97,14.95 38.19,14.73 U3.47 ; U4.18 24.07,17.8 24.38,17.49 24.38,15.96 ; 33.91,16.34 33.69,16.56 U3.23
  vias: v1(1.4,44.16) v1(1.4,41.62) v1(1.4,39.08) v1(1.4,36.54) v1(1.4,34) v1(1.4,31.46) v1(1.4,28.92) v1(1.4,26.38) v1(1.4,23.84) v1(1.4,21.3) v1(1.4,18.76) v1(1.4,16.22) v1(1.4,13.68) v1(1.4,11.14) v1(1.4,8.6) v1(1.4,6.06) v1(3.94,49.24) v1(3.94,44.16) v1(3.94,41.62) v1(3.94,39.08) v1(3.94,36.54) v1(3.94,34) v1(3.94,31.46) v1(3.94,28.92) v1(3.94,26.38) v1(3.94,23.84) v1(3.94,21.3) v1(3.94,18.76) v1(3.94,16.22) v1(3.94,13.68) v1(3.94,11.14) v1(3.94,8.6) v1(3.94,6.06) v1(6.48,49.24) v1(6.48,46.7) v1(6.48,41.62) v1(6.48,39.08) v1(6.48,0.98) v1(9.02,49.24) v1(9.02,46.7) v1(9.02,26.38) v1(9.02,23.84) v1(9.02,21.3) v1(9.02,18.76) v1(9.02,11.14) v1(9.02,8.6) v1(9.02,0.98) v1(11.56,49.24) v1(11.56,46.7) v1(11.56,44.16) v1(11.56,36.54) v1(11.56,34) v1(11.56,28.92) v1(11.56,26.38) v1(11.56,0.98) v1(14.1,36.54) v1(14.1,34) v1(14.1,26.38) v1(14.1,23.84) v1(14.1,0.98) v1(16.64,26.38) v1(16.64,8.6) v1(16.64,0.98) v1(19.18,16.22) v1(19.18,8.6) v1(19.18,6.06) v1(19.18,0.98) v1(21.72,8.6) v1(21.72,0.98) v1(24.26,49.24) v1(24.26,8.6) v1(24.26,0.98) v1(26.54,25.11) v1(26.8,49.24) v1(26.8,44.16) v1(26.8,41.62) v1(26.8,39.08) v1(26.8,36.54) v1(26.8,34) v1(26.8,28.92) v1(26.8,0.98) v1(28.96,14.82) v1(29.34,49.24) v1(29.34,44.16) v1(29.34,36.54) v1(29.34,28.92) v1(29.34,0.98) v1(31.88,49.24) v1(31.88,44.16) v1(31.88,36.54) v1(31.88,34) v1(31.88,28.92) v1(31.88,13.68) v1(31.88,0.98) v1(34.42,49.24) v1(34.42,44.16) v1(34.42,39.08) v1(34.42,36.54) v1(34.42,34) v1(34.42,28.92) v1(34.42,0.98) v1(35.69,15.33) v1(36.96,49.24) v1(36.96,44.16) v1(36.96,36.54) v1(36.96,0.98) v1(38.61,18.5) v1(39.5,49.24) v1(39.5,44.16) v1(39.5,36.54) v1(39.5,0.98) v1(42.04,49.24) v1(42.04,44.16) v1(42.04,36.54) v1(42.04,28.92) v1(42.04,13.68) v1(42.04,0.98) v1(44.58,49.24) v1(44.58,6.06) v1(44.58,0.98) v1(46.48,21.93) v1(46.86,19.14) v1(47.12,49.24) v1(47.12,34) v1(47.12,28.92) v1(47.12,26.38) v1(47.12,23.84) v1(47.12,11.14) v1(47.12,6.06) v1(47.12,0.98) v1(49.66,49.24) v1(49.66,44.16) v1(49.66,41.62) v1(49.66,39.08) v1(49.66,36.54) v1(49.66,34) v1(49.66,31.46) v1(49.66,26.38) v1(49.66,13.68) v1(49.66,11.14) v1(49.66,0.98) v1(52.2,49.24) v1(52.2,13.68) v1(52.2,11.14) v1(52.2,3.52) v1(52.2,0.98) v1(54.74,49.24) v1(54.74,46.7) v1(54.74,44.16) v1(54.74,41.62) v1(54.74,34) v1(54.74,26.38) v1(54.74,16.22) v1(54.74,11.14) v1(54.74,3.52) v1(54.74,0.98) v1(57.28,49.24) v1(57.28,46.7) v1(57.28,44.16) v1(57.28,41.62) v1(57.28,34) v1(57.28,26.38) v1(57.28,21.3) v1(57.28,16.22) v1(57.28,8.6) v1(57.28,3.52) v1(57.28,0.98) v1(59.82,49.24) v1(59.82,46.7) v1(59.82,44.16) v1(59.82,39.08) v1(59.82,31.46) v1(59.82,28.92) v1(59.82,26.38) v1(59.82,23.84) v1(59.82,21.3) v1(59.82,18.76) v1(59.82,16.22) v1(59.82,13.68) v1(59.82,11.14) v1(59.82,8.6) v1(59.82,6.06) v1(59.82,3.52) v1(59.82,0.98) v1(62.36,49.24) v1(62.36,46.7) v1(62.36,44.16) v1(62.36,39.08) v1(62.36,26.38) v1(62.36,23.84) v1(62.36,21.3) v1(62.36,18.76) v1(62.36,16.22) v1(62.36,13.68) v1(62.36,11.14) v1(62.36,8.6) v1(62.36,6.06) v1(62.36,3.52) v1(62.36,0.98) v1(64.9,49.24) v1(64.9,46.7) v1(64.9,44.16) v1(64.9,41.62) v1(64.9,39.08) v1(64.9,26.38) v1(64.9,23.84) v1(64.9,21.3) v1(64.9,16.22) v1(64.9,8.6) v1(64.9,6.06) v1(64.9,3.52) v1(64.9,0.98) v1(67.44,44.16) v1(67.44,41.62) v1(67.44,39.08) v1(67.44,26.38) v1(67.44,23.84) v1(67.44,21.3) v1(67.44,18.76) v1(67.44,16.22) v1(67.44,13.68) v1(67.44,11.14) v1(67.44,8.6) v1(67.44,6.06) v1(69.98,49.24) v1(69.98,44.16) v1(69.98,41.62) v1(69.98,39.08) v1(69.98,36.54) v1(69.98,34) v1(69.98,31.46) v1(69.98,28.92) v1(69.98,26.38) v1(69.98,23.84) v1(69.98,21.3) v1(69.98,18.76) v1(69.98,16.22) v1(69.98,13.68) v1(69.98,11.14) v1(69.98,8.6) v1(69.98,6.06) v1(69.98,0.98)
VCC3V3: length 120.6
  Top Layer w0.305: v1(30.23,9.61) 30.23,14.31 30.78,14.86 U3.36 ; R5.2 52.58,24.09 ; 43.8,10.12 41.15,10.12 ; 43.8,10.12 43.82,10.15 R7.1 ; 43.8,10.12 57.91,10.12 58.67,10.88 58.67,13.91 ; 41.15,10.12 v1(36.32,10.12) ; 41.15,10.12 40.58,10.69 C19.2 38.99,11.65 38.69,11.94 U3.48 38.69,14.65 38.91,14.86 U3.1 ; 58.67,13.91 58.67,23.46 58.04,24.09 48.51,24.09 47.42,25.19 U1.4 43.88,24.61 43.88,21.3 42.98,21.3 42.67,20.99 42.67,20.03 41.51,18.86 U3.9 ; 58.67,13.91 58.67,13.91 R6.1 ; U3.24 33.12,21.93 26.04,21.93 25.65,22.31 25.65,25.49 26.04,25.87 32.89,25.87 33.15,25.62 R2.1
  Top Layer w0.508: 44.27,25.93 C12.2 C13.2 C21.2 35.81,25.21 35.58,24.98 33.16,24.98 R2.1
  Bottom Layer w0.305: v1(36.32,10.12) 35.81,9.61 v1(30.23,9.61)
AIN1: length 8.6
  Top Layer w0.305: U4.21 23.24,19.86 U3.26
AIN2: length 8.6
  Top Layer w0.305: U4.22 23.15,20.36 U3.25
AO1: length 7.7
  Top Layer w0.305: CN1.1 14.94,24.9 16,23.84 16,21.05 16,21.05
AO2: length 8.4
  Top Layer w0.305: U4.5 U4.6 14.04,18.45 13.84,18.25 13.84,15.12 13.54,14.82 11.56,14.82
I2C1_SCL: length 28.3
  Top Layer w0.305: U3.42 35.69,12 35.09,11.39 v1(33.91,11.39) ; v1(14.22,11.39) H2.4
  Bottom Layer w0.305: v1(14.22,11.39) v1(33.91,11.39)
I2C1_SDA: length 31.3
  Top Layer w0.305: U3.43 36.19,11.12 35.57,10.5 v1(33.91,10.5) ; v1(11.68,10.5) H2.3
  Bottom Layer w0.305: v1(11.68,10.5) v1(33.91,10.5)
KEY1: length 19.8
  Top Layer w0.305: 54.75,12.41 54.62,12.53 ; 54.75,12.41 KEY1.1 ; 54.75,12.41 47.37,12.41 47.12,12.66 47.12,15.07 46.74,15.46 44.07,15.46 43.16,16.36 U3.4
LED1: length 5.5
  Top Layer w0.305: U3.3 42.9,15.86 43.82,14.95 43.82,13.46 LED2.1
NRST: length 19.6
  Top Layer w0.305: v1(41.66,18.12) 41.4,17.86 U3.7 ; RST1.2 54.81,19.27 C17.1 54.71,19.17 R5.1 52.58,19.16 52.58,17.36 52.2,16.98 v1(46.86,16.98)
  Bottom Layer w0.305: v1(41.66,18.12) 46.48,18.12 46.86,17.74 v1(46.86,16.98)
OSC_IN: length 12
  Top Layer w0.305: U3.5 43.76,16.86 43.88,16.98 43.88,17.55 44.2,17.87 50.04,17.87 50.29,18.12 50.29,19.14 X1.3
OSC_OUT: length 11.6
  Top Layer w0.305: U3.6 42.3,17.36 42.55,17.61 42.55,18.88 42.8,19.14 43.88,19.14 43.88,19.71 44.2,20.03 46.61,20.03 46.86,20.28 46.86,21.04 47.12,21.3 48.47,21.3 X1.1
PA0: length 28.8
  Top Layer w0.305: U3.10 35.66,19.36 v1(35.43,19.14)
  Bottom Layer w0.305: v1(35.43,19.14) 11.8,19.14 CN1.4
PA1: length 29.1
  Top Layer w0.305: v1(35.43,20.16) 35.72,19.86 U3.11
  Bottom Layer w0.305: v1(35.43,20.16) 25.27,20.16 24.64,20.79 11.67,20.79 CN1.3
PA2: length 50.1
  Top Layer w0.305: U3.12 41.36,20.36 41.66,20.66 41.66,23.58 41.27,23.96 27.05,23.96 v1(26.8,24.22) ; U5.3 10.22,38.7 18.54,38.7 19.56,37.68 v1(19.56,24.22)
  Bottom Layer w0.305: v1(26.8,24.22) v1(19.56,24.22)
PA3: length 44.2
  Top Layer w0.305: v1(26.67,22.95) 27.05,23.33 38.48,23.33 38.69,23.12 U3.13 ; v1(18.8,22.95) 18.8,37.05 18.39,37.46 U5.4
  Bottom Layer w0.305: v1(26.67,22.95) v1(18.8,22.95)
PA8: length 13.5
  Top Layer w0.305: U3.29 31.7,18.38 32.77,18.38 33.02,18.63 33.02,20.54 32.51,21.05 23.12,21.05
PA9: length 17.7
  Top Layer w0.305: H3.2 25.91,7.07 25.91,17.56 26.21,17.86 U3.30
PA10: length 16.2
  Top Layer w0.305: U3.31 27.05,17.36 26.8,17.11 26.8,6.95 H3.3
PA13: length 37.2
  Top Layer w0.305: H1.3 51.69,8.09 51.05,8.72 27.86,8.72 27.56,9.03 27.56,15.53 27.86,15.84 31.66,15.84 U3.34
PA14: length 27.7
  Top Layer w0.305: 54.23,6.18 54.23,8.85 53.72,9.36 33.5,9.36 33.19,9.66 U3.37
PB10: length 22.1
  Top Layer w0.305: v1(37.59,17.87) 35,17.87 34.69,18.17 U3.21 ; v1(37.59,5.3) 38.48,5.3 38.62,5.43 FPC1.7
  Bottom Layer w0.305: v1(37.59,17.87) v1(37.59,5.3)
PB11: length 23.4
  Top Layer w0.305: U3.22 34.19,17.21 34.8,16.6 v1(38.61,16.6) ; FPC1.4 40.13,7.13 v1(40.13,5.3)
  Bottom Layer w0.305: v1(40.13,5.3) 40.13,15.58 39.12,16.6 v1(38.61,16.6)
$1N3060: length 2
  Top Layer w0.508: R2.2 29.63,24.99 LED1.2
$1N3483: length 1.8
  Top Layer w0.305: LED2.2 45.38,11.69 R7.2
$1N5689: length 1.9
  Top Layer w0.508: R3.2 R4.1
$1N5690: length 8.1
  Top Layer w0.508: U2.4 48.26,37.9 48.26,37.05 47.75,36.54 44.32,36.54 43.95,36.17 R3.1 R1.1
$1N5697: length 2.3
  Top Layer w0.508: C1.2 42.34,37.91 U2.1
$1N5698: length 19
  Top Layer w0.508: U2.8 44.42,43.52 42.8,43.52 42.23,42.95 42.23,40.68 ; C1.1 42.23,40.68 ; 42.23,40.68 42.22,40.68 L1.1 37.03,40.99 D1.1

## Copper pours and planes (outline as drawn; the poured copper is in the pictures)
+5V on Top Layer: 24.77,31.27 42.69,31.27 42.69,30.19 24.77,30.19
+5V on Top Layer: 5.72,31.2 7.49,31.2 7.49,2.38 5.72,2.38
+5V on Top Layer: 29.21,7.71 38.23,7.71 38.23,6.44 29.21,6.44
+5V on Top Layer: 5.72,31.27 18.16,31.27 18.16,30.19 5.72,30.19
+5V on Top Layer: 5.72,7.07 10.03,7.07 10.03,5.3 5.72,5.3
+5V on Top Layer: 5.72,17.49 12.06,17.49 12.06,16.31 5.72,16.31
+5V on Top Layer: 29.21,7.07 30.98,7.07 30.98,1.75 29.21,1.75
+5V on Top Layer: 36.7,34.89 37.95,34.89 37.95,30.35 36.7,30.35
+5V on Top Layer: 48.26,7.07 50.04,7.07 50.04,1.75 48.26,1.75
+5V on Top Layer: 5.72,3.14 50.04,3.14 50.04,1.75 5.72,1.75
+5V on Bottom Layer: 19.03,31.27 25.62,31.27 25.62,30.19 19.03,30.19
+5V on Bottom Layer: 19.03,31.27 25.62,31.27 25.62,30.19 19.03,30.19
+5V on Bottom Layer: 19.03,31.27 25.62,31.27 25.62,30.19 19.03,30.19
+5V on Bottom Layer: 19.03,31.27 25.62,31.27 25.62,30.19 19.03,30.19
+5V on Bottom Layer: 19.03,31.27 25.62,31.27 25.62,30.19 19.03,30.19
+5V on Bottom Layer: 19.03,31.27 25.62,31.27 25.62,30.19 19.03,30.19
+5V on Bottom Layer: 17,31.27 25.87,31.27 25.87,30.19 17,30.19
+12V on Top Layer: 22.48,47.59 51.57,47.59 51.57,46.32 22.48,46.32
+12V on Top Layer: 50.67,47.59 51.57,47.59 51.57,29.15 50.67,29.15
+12V on Top Layer: 20.19,28.92 21.34,28.92 21.34,14.44 20.19,14.44
+12V on Top Layer: 22.48,47.6 23.75,47.6 23.75,21.55 22.48,21.55
+12V on Top Layer: 50.24,31.07 57.91,31.07 57.91,28.16 50.24,28.16
+12V on Top Layer: 20.83,15.33 23.75,15.33 23.75,14.44 20.83,14.44
GND on Top Layer: -1.14,51.65 72.77,51.65 72.77,-1.56 -1.14,-1.56
GND on Top Layer: 40.51,7.71 41.62,7.71 41.62,6.55 40.51,6.55
GND on Bottom Layer: -2.41,53.3 74.3,53.3 74.3,-3.21 -2.41,-3.21
VCC3V3 on Top Layer: 43.94,32.09 44.96,32.09 44.96,24.85 43.94,24.85
$1N11600 on Top Layer: 66.1,35.9 67.95,35.9 67.95,28.03 66.1,28.03
$1N11600 on Top Layer: 61.21,30.95 67.95,30.95 67.95,28.03 61.21,28.03
$1N11600 on Top Layer: 58.17,35.9 67.95,35.9 67.95,33.87 58.17,33.87

Small or netless copper shapes (teardrops, artwork), in the pictures only: 103 on Top Layer, 20 on Bottom Layer

## Text on the board
Top Silkscreen Layer: +5V | SDA | SCL | GND | TX1 | RX1 | TX3 | RX3 | DIO | CLK | TX2 | RX2
